# Altium project МЦТР.00010528.00.001.PrjPcb
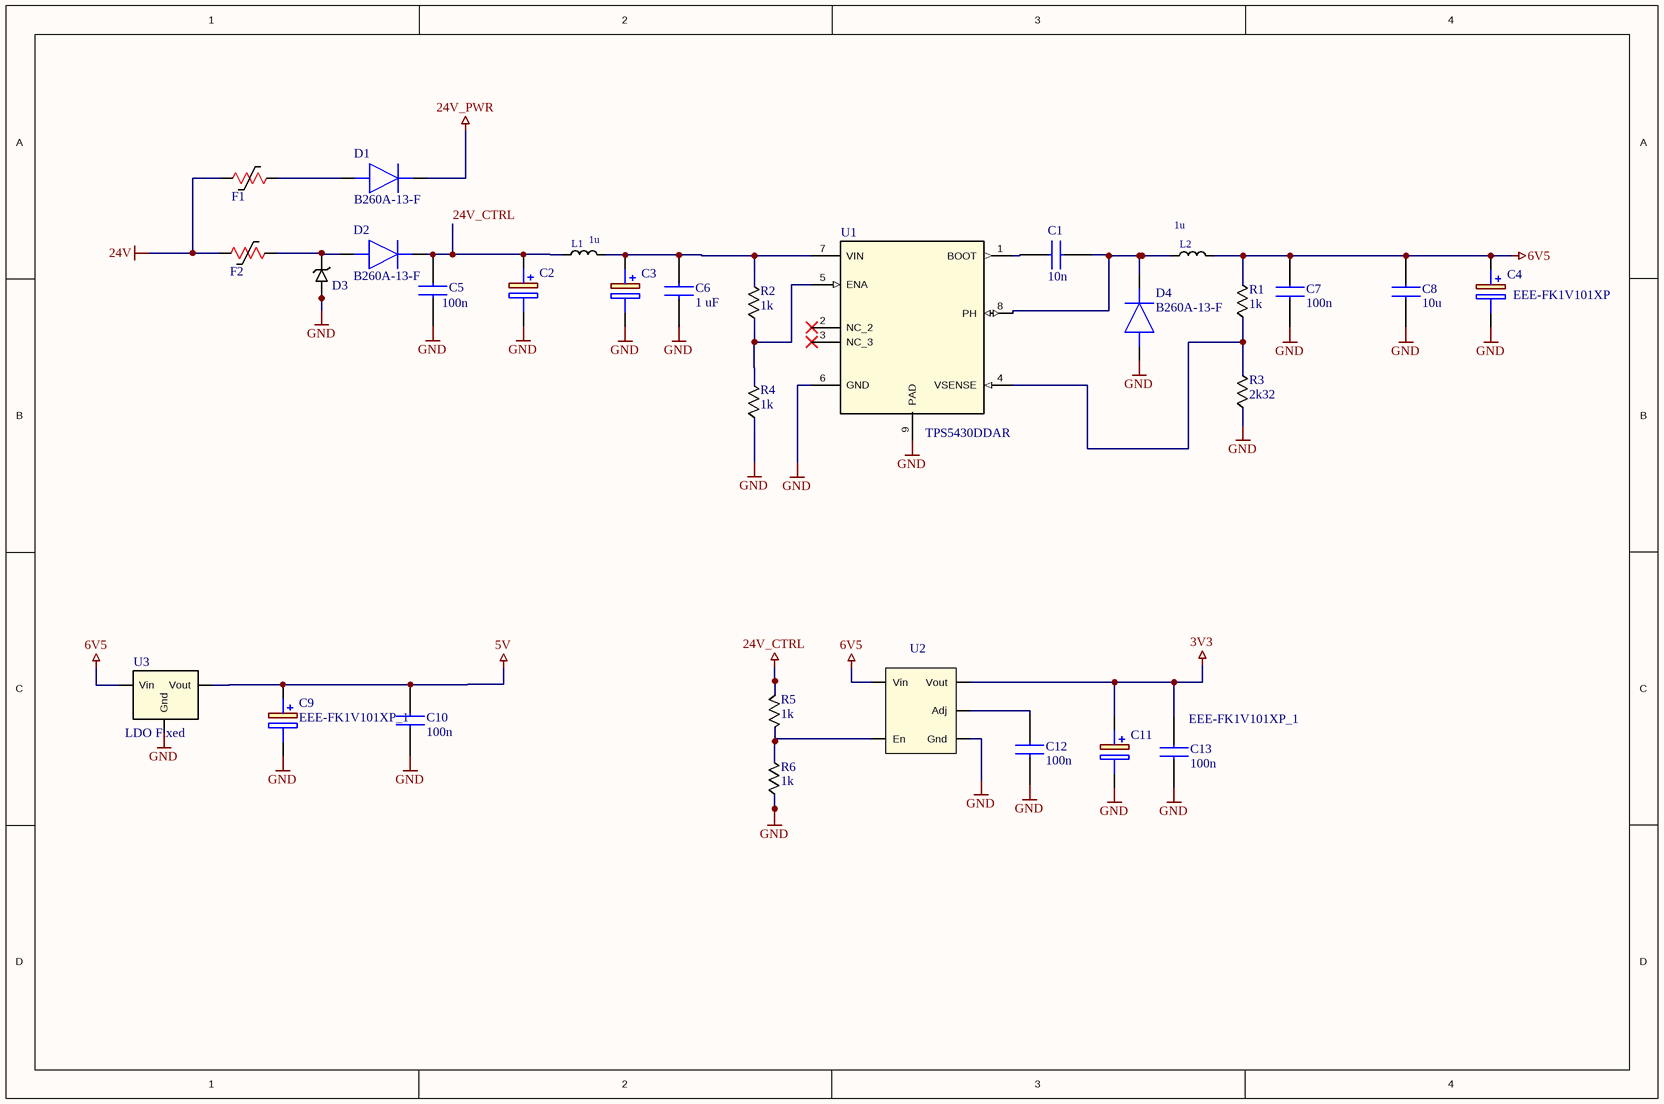
[diagram p0: PSU.SchDoc]
5 sheets, 182 parts. Net scope: global (net labels, ports and power ports of the same name join across sheets).
Board file: PCB1.PcbDoc
Sheets:
  PSU.SchDoc
  MCU.SchDoc
  4-20.SchDoc
  Ethernet.SchDoc
  LEDs.SchDoc

## Sheet PSU.SchDoc
size A4

### Parts
C1  10n  [0603 CAP]
C2  EEE-FK1V101XP  [EEE0JA331XP]  (value not drawn)
C3  EEE-FK1V101XP  [EEE0JA331XP]  (value not drawn)
C4  EEE-FK1V101XP  [EEE0JA331XP]
C5  100n  [0603 CAP]
C6  1 uF  [0603 CAP]
C7  100n  [0603 CAP]
C8  10u  [0603 CAP]
C9  EEE-FK1V101XP_1  [EEE1AA220WR]
C10  100n  [0603 CAP]
C11  EEE-FK1V101XP_1  [EEE1AA220WR]
C12  100n  [0603 CAP]
C13  100n  [0603 CAP]
D1  B260A-13-F  [DO-214AC / SMA - POL]
D2  B260A-13-F  [DO-214AC / SMA - POL]
D3  TVS Diode  [DO-214AC / SMA - POL]  (value not drawn)
D4  B260A-13-F  [DO-214AC / SMA - POL]
F1  MF-USMF005-2  [MF-MSMF030-2]  (value not drawn)
F2  MF-USMF005-2  [MF-MSMF030-2]  (value not drawn)
L1  1u  [CDRH127/LDNP]
L2  1u  [cdRH127/LDNP]
R1  1k  [0603 CAP]
R2  1k  [0603 CAP]
R3  2k32  [0603 CAP]
R4  1k  [0603 CAP]
R5  1k  [0603 CAP]
R6  1k  [0603 CAP]
U1  TPS5430DDAR  [SOIC8 pad]
U2  LDO with Enable Pin  [SOT-23-5]  (value not drawn)
U3  LDO Fixed  [SOT-223]

### Nets
3V3: C11.1(+) C13.2 U2.5(Vout)
5V: C9.1(+) C10.2 U3.2(Vout)
6V5: C4.1(+) C7.2 C8.2 L2.2 R1.2 U2.1(Vin) U3.3(Vin)
24V: F1.2 F2.2
24V_CTRL: C2.1(+) C5.2 D2.2(K) L1.1 R5.1
24V_PWR: D1.2(K)
GND: C2.2(-) C3.2(-) C4.2(-) C5.1 C6.1 C7.1 C8.1 C9.2(-) C10.1 C11.2(-) C12.1 C13.1 D3.1 D4.1(A) R3.1 R4.1 R6.1 U1.6(GND) U1.9(PAD) U2.2(Gnd) U3.1(Gnd)
NetC1_1: C1.1 U1.1(BOOT)
NetC1_2: C1.2 D4.2(K) L2.1 U1.8(PH)
NetC3_1: C3.1(+) C6.2 L1.2 R2.2 U1.7(VIN)
NetC12_2: C12.2 U2.4(Adj)
NetD1_1: D1.1(A) F1.1
NetD2_1: D2.1(A) D3.2 F2.1
NetR1_1: R1.1 R3.2 U1.4(VSENSE)
NetR2_1: R2.1 R4.2 U1.5(ENA)
NetR5_2: R5.2 R6.2 U2.3(En)

Not connected (* = marked no-connect by the designer): U1 2(NC_2)* 3(NC_3)*

### Library data of the parts
C1 = 0603 CAP: GRM188R72A103KA01D; Manufacturer_Name: Murata Electronics; Datasheet Link: https://search.murata.co.jp/Ceramy/image/img/A01X/G101/ENG/GRM188R72A103KA01-01A.pdf; Height: 0.9mm; Manufacturer_Part_Number: GRM188R72A103KA01D; Mouser Part Number: 81-GRM188R72A103KA1D; Mouser Price/Stock: https://www.mouser.co.uk/ProductDetail/Murata-Electronics/GRM188R72A103KA01D?qs=krk%2F6UQjCzAtl9phuocbug%3D%3D; Arrow Part Number: GRM188R72A103KA01D; Arrow Price/Stock: https://www.arrow.com/en/products/grm188r72a103ka01d/murata-manufacturing?region=europe
C2-C4 = EEE-FK1V101XP: Capacitor Polarised; Manufacturer_Name: Panasonic; Datasheet Link: http://industrial.panasonic.com/cdbs/www-data/pdf/RDE0000/ABA0000C1181.pdf; Height: 7.8mm; Manufacturer_Part_Number: EEE-FK1V101XP; Mouser Part Number: 667-EEE-FK1V101XP; Mouser Price/Stock: https://www.mouser.co.uk/ProductDetail/Panasonic/EEE-FK1V101XP?qs=qE6bgDGEOCu46KIpIgG5Yw%3D%3D; Arrow Part Number: EEE-FK1V101XP; Arrow Price/Stock: https://www.arrow.com/en/products/eee-fk1v101xp/panasonic?utm_currency=USD&region=europe
C5 C7 C10 C12 C13 = 0603 CAP: CC0603KRX7R9BB104; Manufacturer_Name: Murata Electronics; Manufacturer_Part_Number: GRM188R72A103KA01D; Datasheet Link: https://search.murata.co.jp/Ceramy/image/img/A01X/G101/ENG/GRM188R72A103KA01-01A.pdf; Height: 0.9mm; Mouser Part Number: 81-GRM188R72A103KA1D; Mouser Price/Stock: https://www.mouser.co.uk/ProductDetail/Murata-Electronics/GRM188R72A103KA01D?qs=krk%2F6UQjCzAtl9phuocbug%3D%3D; Arrow Part Number: GRM188R72A103KA01D; Arrow Price/Stock: https://www.arrow.com/en/products/grm188r72a103ka01d/murata-manufacturing?region=europe
C6 = 0603 CAP: CC0603KRX7R9BB105; Manufacturer_Name: Murata Electronics; Manufacturer_Part_Number: GRM188R72A103KA01D; Datasheet Link: https://search.murata.co.jp/Ceramy/image/img/A01X/G101/ENG/GRM188R72A103KA01-01A.pdf; Height: 0.9mm; Mouser Part Number: 81-GRM188R72A103KA1D; Mouser Price/Stock: https://www.mouser.co.uk/ProductDetail/Murata-Electronics/GRM188R72A103KA01D?qs=krk%2F6UQjCzAtl9phuocbug%3D%3D; Arrow Part Number: GRM188R72A103KA01D; Arrow Price/Stock: https://www.arrow.com/en/products/grm188r72a103ka01d/murata-manufacturing?region=europe
C8 = 0603 CAP: GRM188R61E105KA12D; Manufacturer_Name: Murata Electronics; Manufacturer_Part_Number: GRM188R72A103KA01D; Datasheet Link: https://search.murata.co.jp/Ceramy/image/img/A01X/G101/ENG/GRM188R72A103KA01-01A.pdf; Height: 0.9mm; Mouser Part Number: 81-GRM188R72A103KA1D; Mouser Price/Stock: https://www.mouser.co.uk/ProductDetail/Murata-Electronics/GRM188R72A103KA01D?qs=krk%2F6UQjCzAtl9phuocbug%3D%3D; Arrow Part Number: GRM188R72A103KA01D; Arrow Price/Stock: https://www.arrow.com/en/products/grm188r72a103ka01d/murata-manufacturing?region=europe
C9 C11 = EEE-FK1V101XP_1: EEEFK1C100R; Manufacturer_Name: Panasonic; Datasheet Link: http://industrial.panasonic.com/cdbs/www-data/pdf/RDE0000/ABA0000C1181.pdf; Height: 7.8mm; Manufacturer_Part_Number: EEE-FK1V101XP; Mouser Part Number: 667-EEE-FK1V101XP; Mouser Price/Stock: https://www.mouser.co.uk/ProductDetail/Panasonic/EEE-FK1V101XP?qs=qE6bgDGEOCu46KIpIgG5Yw%3D%3D; Arrow Part Number: EEE-FK1V101XP; Arrow Price/Stock: https://www.arrow.com/en/products/eee-fk1v101xp/panasonic?utm_currency=USD&region=europe
D1 D2 D4 = B260A-13-F: Diode; Manufacturer_Name: Diodes Incorporated; Datasheet Link: https://componentsearchengine.com/Datasheets/2/B260A-13-F.pdf; Height: 2.3mm; Manufacturer_Part_Number: B260A-13-F; Mouser Part Number: 621-B260A-F; Mouser Price/Stock: https://www.mouser.co.uk/ProductDetail/Diodes-Incorporated/B260A-13-F?qs=9XwZYT68TnR%252B3fnyovGFLA%3D%3D; Arrow Part Number: B260A-13-F; Arrow Price/Stock: https://www.arrow.com/en/products/b260a-13-f/diodes-incorporated?region=nac
D3 = TVS_1_Uni: TVS Protective Diode Uni
F1 F2 = Fuse Resettable: Resettable Fuse Polyswitch
L1 L2 = Inductor CDRH127: SMD 0805; Value: 1u
R1 R2 R4-R6 = 0603 RES
R3 = RES 0603: RC0603FR-072K32L
U2 = LM8805
U3 = LDO Fixed S

## Sheet MCU.SchDoc
size A3
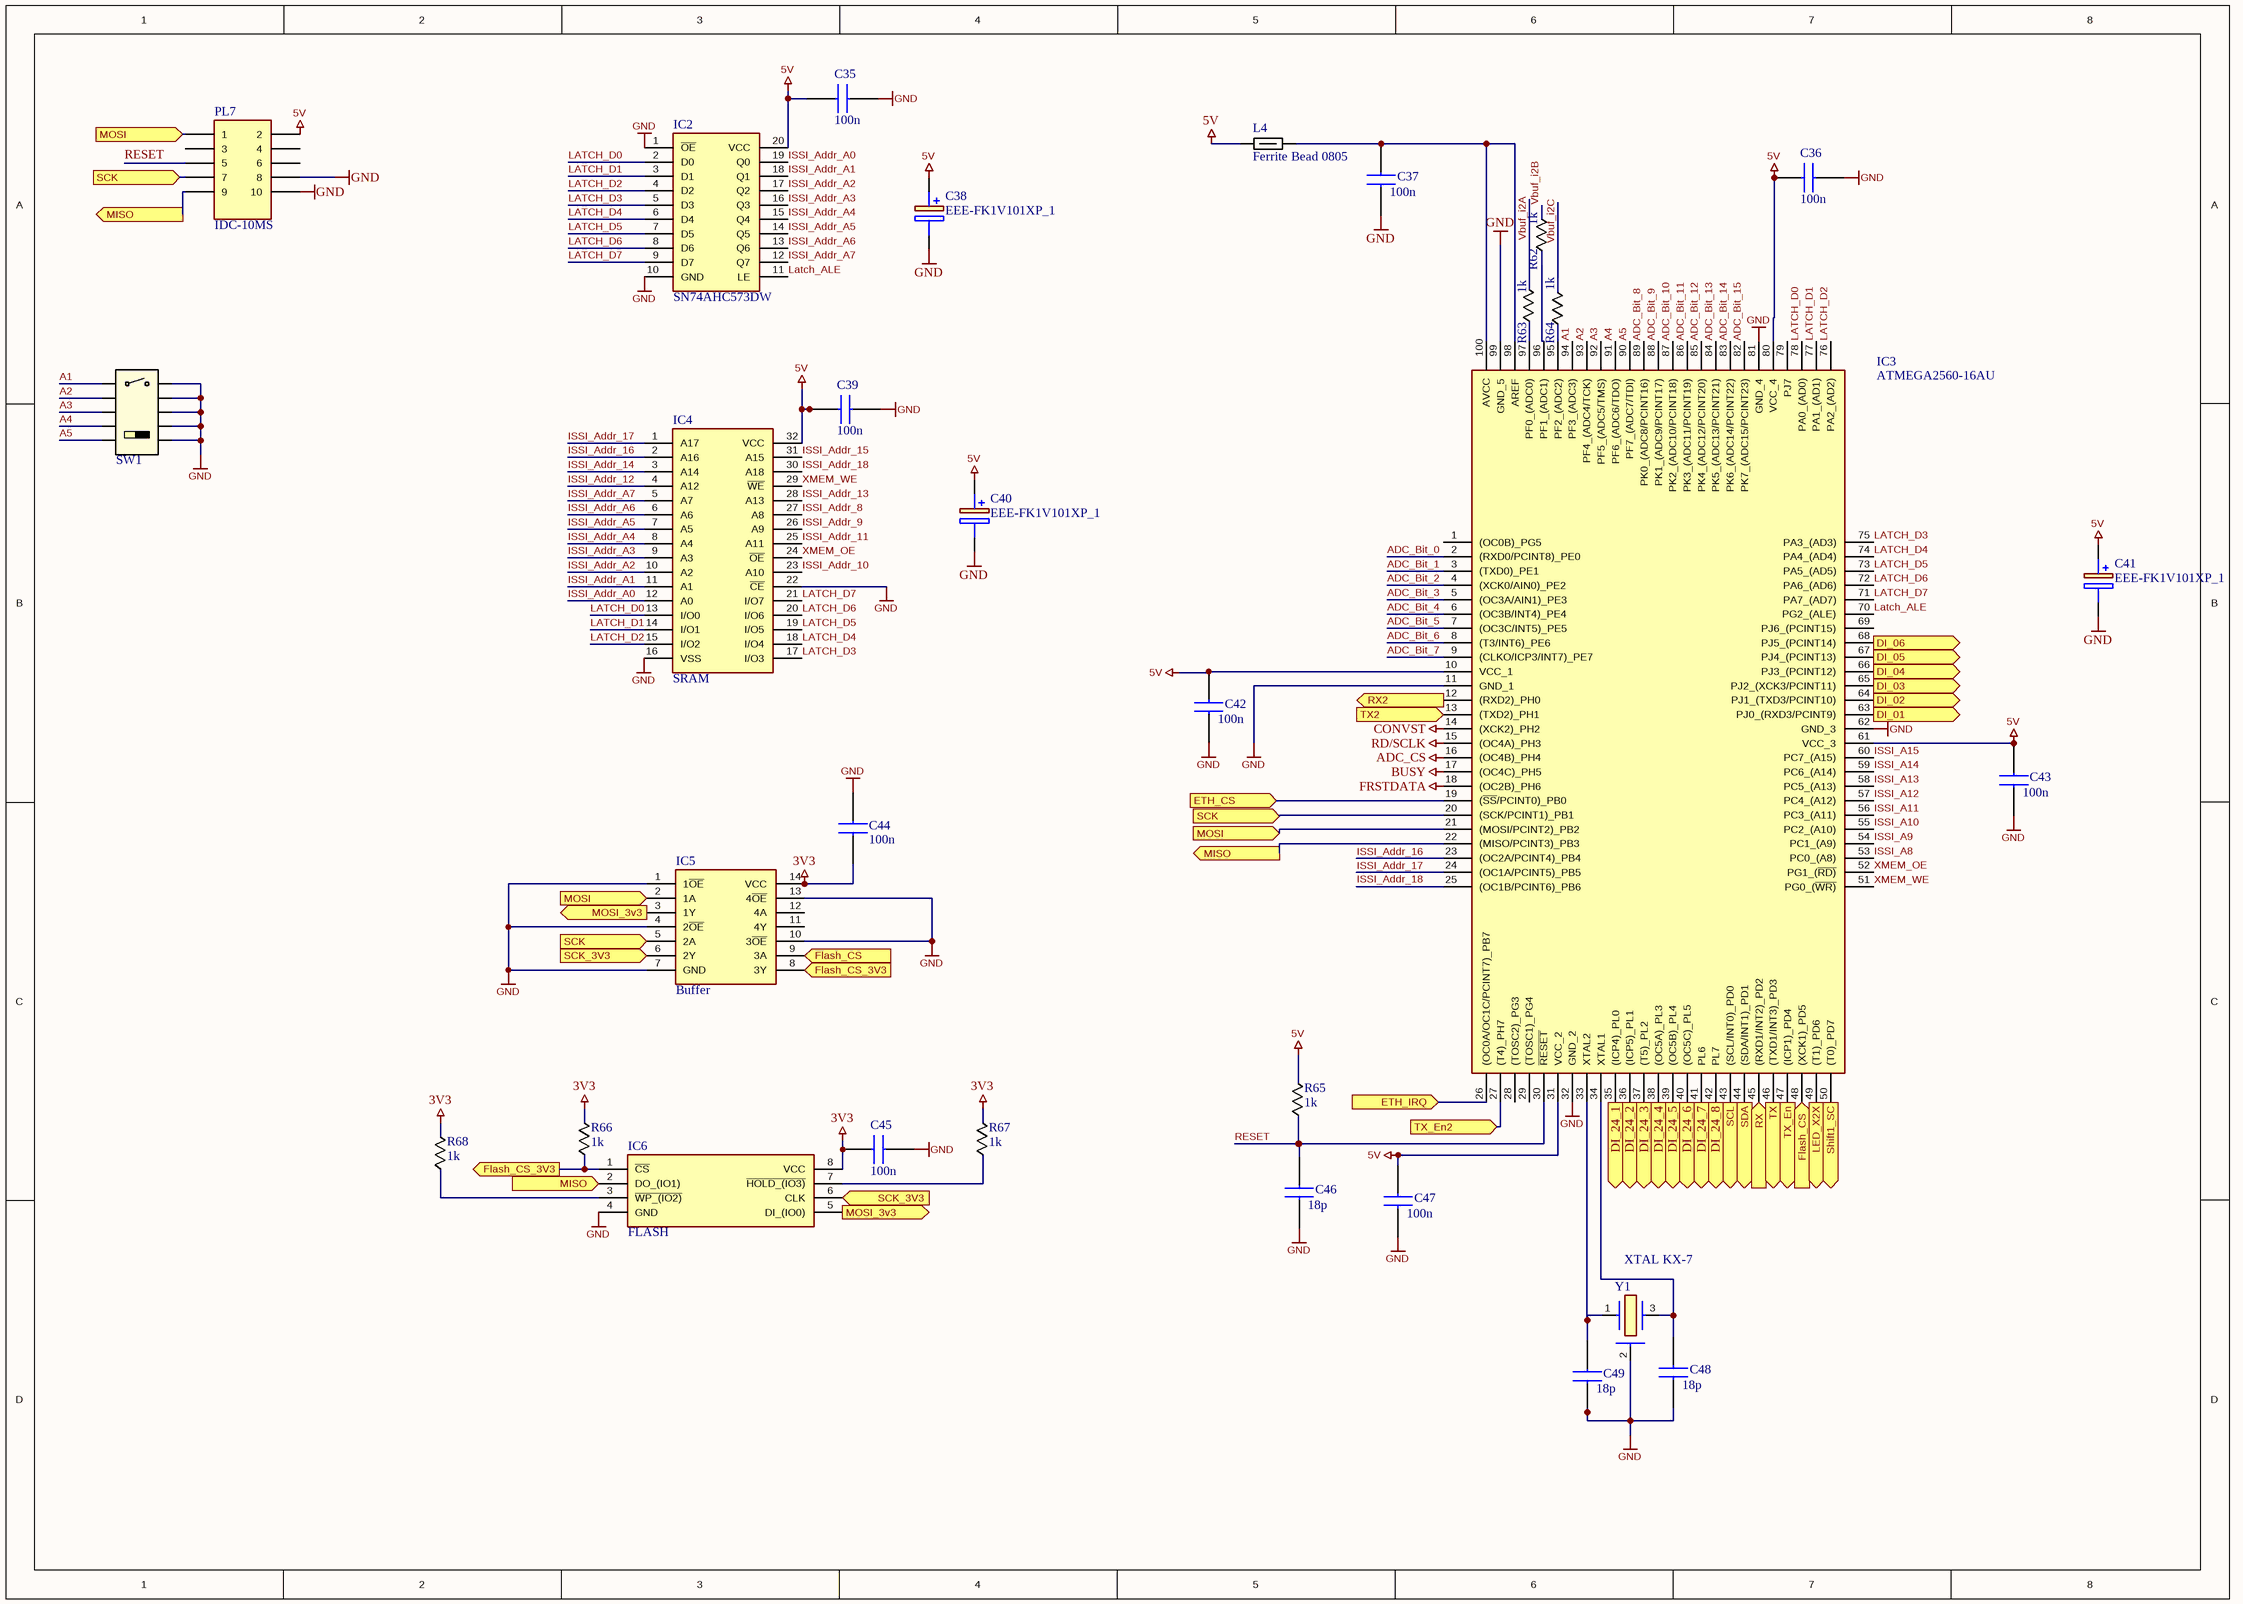
[diagram p1: MCU.SchDoc]

### Parts
C35  100n  [0603 CAP]
C36  100n  [0603 CAP]
C37  100n  [0603 CAP]
C38  EEE-FK1V101XP_1  [EEE1AA220WR]
C39  100n  [0603 CAP]
C40  EEE-FK1V101XP_1  [EEE1AA220WR]
C41  EEE-FK1V101XP_1  [EEE1AA220WR]
C42  100n  [0603 CAP]
C43  100n  [0603 CAP]
C44  100n  [0603 CAP]
C45  100n  [0603 CAP]
C46  18p  [0603 CAP]
C47  100n  [0603 CAP]
C48  18p  [0603 CAP]
C49  18p  [0603 CAP]
IC2  SN74AHC573DW  [SOIC-20N]
IC3  ATMEGA2560-16AU  [QFP-100N]
IC4  SRAM  [SOIC32]
IC5  Buffer  [SOP-14N]
IC6  FLASH  [SOIC-8]
L4  Ferrite Bead 0805  [BLM21AG102BH1J]
PL7  IDC-10MS  [DS101310SSIB1B0]
R62  1k  [0603 CAP]
R63  1k  [0603 CAP]
R64  1k  [0603 CAP]
R65  1k  [0603 CAP]
R66  1k  [0603 CAP]
R67  1k  [0603 CAP]
R68  1k  [0603 CAP]
SW1  DIP-Switch 5 Pins  [Switch DIP-5]  (value not drawn)
Y1  XTAL KX-7  [XTAL KX-7]

### Ports
DI_01, DI_02, DI_03, DI_04, DI_05, DI_06, DI_24_1, DI_24_2, DI_24_3, DI_24_4, DI_24_5, DI_24_6, DI_24_7, DI_24_8, ETH_CS, ETH_IRQ, Flash_CS, Flash_CS_3V3, LED_X2X, MISO, MOSI, MOSI_3v3, RX, RX2, SCK, SCK_3V3, SCL, SDA, Shift1_SC, TX, TX2, TX_En, TX_En2

### Nets
3V3: C44.1 C45.1 IC5.14(VCC) IC6.8(VCC) R66.2 R67.2 R68.2
5V: C35.2 C36.2 C38.1(+) C39.2 C40.1(+) C41.1(+) C42.2 C43.2 C47.2 IC2.20(VCC) IC3.10(VCC_1) IC3.31(VCC_2) IC3.61(VCC_3) IC3.80(VCC_4) IC4.32(VCC) L4.1 PL7.2 R65.2
ADC_CS: IC3.16((OC4B)_PH4)
BUSY: IC3.17((OC4C)_PH5)
CONVST: IC3.14((XCK2)_PH2)
FRSTDATA: IC3.18((OC2B)_PH6)
GND: C35.1 C36.1 C37.1 C38.2(-) C39.1 C40.2(-) C41.2(-) C42.1 C43.1 C44.2 C45.2 C46.1 C47.1 C48.1 C49.1 IC2.1(~{OE}) IC2.10(GND) IC3.11(GND_1) IC3.32(GND_2) IC3.62(GND_3) IC3.81(GND_4) IC3.99(GND_5) IC4.16(VSS) IC4.22(~{CE}) IC5.1(1~{OE}) IC5.4(2~{OE}) IC5.7(GND) IC5.10(3~{OE}) IC5.13(4~{OE}) IC6.4(GND) PL7.8 PL7.10 SW1.2 SW1.4 SW1.6 SW1.8 SW1.10 Y1.2
RD/SCLK: IC3.15((OC4A)_PH3)
A1: IC3.94(PF3_(ADC3)) SW1.1
A2: IC3.93(PF4_(ADC4/TCK)) SW1.3
A3: IC3.92(PF5_(ADC5/TMS)) SW1.5
A4: IC3.91(PF6_(ADC6/TDO)) SW1.7
A5: IC3.90(PF7_(ADC7/TDI)) SW1.9
ADC_Bit_0: IC3.2((RXD0/PCINT8)_PE0)
ADC_Bit_1: IC3.3((TXD0)_PE1)
ADC_Bit_2: IC3.4((XCK0/AIN0)_PE2)
ADC_Bit_3: IC3.5((OC3A/AIN1)_PE3)
ADC_Bit_4: IC3.6((OC3B/INT4)_PE4)
ADC_Bit_5: IC3.7((OC3C/INT5)_PE5)
ADC_Bit_6: IC3.8((T3/INT6)_PE6)
ADC_Bit_7: IC3.9((CLKO/ICP3/INT7)_PE7)
ADC_Bit_8: IC3.89(PK0_(ADC8/PCINT16))
ADC_Bit_9: IC3.88(PK1_(ADC9/PCINT17))
ADC_Bit_10: IC3.87(PK2_(ADC10/PCINT18))
ADC_Bit_11: IC3.86(PK3_(ADC11/PCINT19))
ADC_Bit_12: IC3.85(PK4_(ADC12/PCINT20))
ADC_Bit_13: IC3.84(PK5_(ADC13/PCINT21))
ADC_Bit_14: IC3.83(PK6_(ADC14/PCINT22))
ADC_Bit_15: IC3.82(PK7_(ADC15/PCINT23))
DI_01: IC3.63(PJ0_(RXD3/PCINT9)) ; port DI_01
DI_02: IC3.64(PJ1_(TXD3/PCINT10)) ; port DI_02
DI_03: IC3.65(PJ2_(XCK3/PCINT11)) ; port DI_03
DI_04: IC3.66(PJ3_(PCINT12)) ; port DI_04
DI_05: IC3.67(PJ4_(PCINT13)) ; port DI_05
DI_06: IC3.68(PJ5_(PCINT14)) ; port DI_06
DI_24_1: IC3.35((ICP4)_PL0) ; port DI_24_1
DI_24_2: IC3.36((ICP5)_PL1) ; port DI_24_2
DI_24_3: IC3.37((T5)_PL2) ; port DI_24_3
DI_24_4: IC3.38((OC5A)_PL3) ; port DI_24_4
DI_24_5: IC3.39((OC5B)_PL4) ; port DI_24_5
DI_24_6: IC3.40((OC5C)_PL5) ; port DI_24_6
DI_24_7: IC3.41(PL6) ; port DI_24_7
DI_24_8: IC3.42(PL7) ; port DI_24_8
ETH_CS: IC3.19((~{SS}/PCINT0)_PB0) ; port ETH_CS
ETH_IRQ: IC3.26((OC0A/OC1C/PCINT7)_PB7) ; port ETH_IRQ
Flash_CS: IC3.48((XCK1)_PD5) IC5.9(3A) ; port Flash_CS
Flash_CS_3V3: IC5.8(3Y) IC6.1(~{CS}) R66.1 ; port Flash_CS_3V3
ISSI_A8: IC3.53(PC0_(A8))
ISSI_A9: IC3.54(PC1_(A9))
ISSI_A10: IC3.55(PC2_(A10))
ISSI_A11: IC3.56(PC3_(A11))
ISSI_A12: IC3.57(PC4_(A12))
ISSI_A13: IC3.58(PC5_(A13))
ISSI_A14: IC3.59(PC6_(A14))
ISSI_A15: IC3.60(PC7_(A15))
ISSI_Addr_8: IC4.27(A8)
ISSI_Addr_9: IC4.26(A9)
ISSI_Addr_10: IC4.23(A10)
ISSI_Addr_11: IC4.25(A11)
ISSI_Addr_12: IC4.4(A12)
ISSI_Addr_13: IC4.28(A13)
ISSI_Addr_14: IC4.3(A14)
ISSI_Addr_15: IC4.31(A15)
ISSI_Addr_16: IC3.23((OC2A/PCINT4)_PB4) IC4.2(A16)
ISSI_Addr_17: IC3.24((OC1A/PCINT5)_PB5) IC4.1(A17)
ISSI_Addr_18: IC3.25((OC1B/PCINT6)_PB6) IC4.30(A18)
ISSI_Addr_A0: IC2.19(Q0) IC4.12(A0)
ISSI_Addr_A1: IC2.18(Q1) IC4.11(A1)
ISSI_Addr_A2: IC2.17(Q2) IC4.10(A2)
ISSI_Addr_A3: IC2.16(Q3) IC4.9(A3)
ISSI_Addr_A4: IC2.15(Q4) IC4.8(A4)
ISSI_Addr_A5: IC2.14(Q5) IC4.7(A5)
ISSI_Addr_A6: IC2.13(Q6) IC4.6(A6)
ISSI_Addr_A7: IC2.12(Q7) IC4.5(A7)
Latch_ALE: IC2.11(LE) IC3.70(PG2_(ALE))
LATCH_D0: IC2.2(D0) IC3.78(PA0_(AD0)) IC4.13(I/O0)
LATCH_D1: IC2.3(D1) IC3.77(PA1_(AD1)) IC4.14(I/O1)
LATCH_D2: IC2.4(D2) IC3.76(PA2_(AD2)) IC4.15(I/O2)
LATCH_D3: IC2.5(D3) IC3.75(PA3_(AD3)) IC4.17(I/O3)
LATCH_D4: IC2.6(D4) IC3.74(PA4_(AD4)) IC4.18(I/O4)
LATCH_D5: IC2.7(D5) IC3.73(PA5_(AD5)) IC4.19(I/O5)
LATCH_D6: IC2.8(D6) IC3.72(PA6_(AD6)) IC4.20(I/O6)
LATCH_D7: IC2.9(D7) IC3.71(PA7_(AD7)) IC4.21(I/O7)
LED_X2X: IC3.49((T1)_PD6) ; port LED_X2X
MISO: IC3.22((MISO/PCINT3)_PB3) IC6.2(DO_(IO1)) PL7.9 ; port MISO
MOSI: IC3.21((MOSI/PCINT2)_PB2) IC5.2(1A) PL7.1 ; port MOSI
MOSI_3v3: IC5.3(1Y) IC6.5(DI_(IO0)) ; port MOSI_3v3
RESET: C46.2 IC3.30(~{RESET}) PL7.5 R65.1
RX: IC3.45((RXD1/INT2)_PD2) ; port RX
RX2: IC3.12((RXD2)_PH0) ; port RX2
SCK: IC3.20((SCK/PCINT1)_PB1) IC5.5(2A) PL7.7 ; port SCK
SCK_3V3: IC5.6(2Y) IC6.6(CLK) ; port SCK_3V3
SCL: IC3.43((SCL/INT0)_PD0) ; port SCL
SDA: IC3.44((SDA/INT1)_PD1) ; port SDA
Shift1_SC: IC3.50((T0)_PD7) ; port Shift1_SC
TX: IC3.46((TXD1/INT3)_PD3) ; port TX
TX2: IC3.13((TXD2)_PH1) ; port TX2
TX_En: IC3.47((ICP1)_PD4) ; port TX_En
TX_En2: IC3.27((T4)_PH7) ; port TX_En2
Vbuf_i2A: R63.2
Vbuf_i2B: R62.2
Vbuf_i2C: R64.2
XMEM_OE: IC3.52(PG1_(~{RD)}) IC4.24(~{OE})
XMEM_WE: IC3.51(PG0_(~{WR)}) IC4.29(~{WE})
NetC37_2: C37.2 IC3.98(AREF) IC3.100(AVCC) L4.2
NetC48_2: C48.2 IC3.34(XTAL1) Y1.3
NetC49_2: C49.2 IC3.33(XTAL2) Y1.1
NetIC3_95: IC3.95(PF2_(ADC2)) R64.1
NetIC3_96: IC3.96(PF1_(ADC1)) R62.1
NetIC3_97: IC3.97(PF0_(ADC0)) R63.1
NetIC6_3: IC6.3(~{WP_(IO2)}) R68.1
NetIC6_7: IC6.7(~{HOLD_(IO3)}) R67.1

Not connected (* = marked no-connect by the designer): IC3 1((OC0B)_PG5) 28((TOSC2)_PG3) 29((TOSC1)_PG4) 69(PJ6_(PCINT15)) 79(PJ7); IC5 11(4Y) 12(4A); PL7 3 4 6

### Library data of the parts
C35-C37 C39 C42-C45 C47 = 0603 CAP: as C5 on sheet PSU; Datasheet Link: https://search.murata.co.jp/Ceramy/image/img/A01X/G101/ENG/GRM188R72A103KA01-01A.pdf; Height: 0.9mm; Mouser Part Number: 81-GRM188R72A103KA1D; Mouser Price/Stock: https://www.mouser.co.uk/ProductDetail/Murata-Electronics/GRM188R72A103KA01D?qs=krk%2F6UQjCzAtl9phuocbug%3D%3D; Arrow Part Number: GRM188R72A103KA01D; Arrow Price/Stock: https://www.arrow.com/en/products/grm188r72a103ka01d/murata-manufacturing?region=europe
C38 C40 C41 = EEE-FK1V101XP_1: as C9 on sheet PSU; Datasheet Link: http://industrial.panasonic.com/cdbs/www-data/pdf/RDE0000/ABA0000C1181.pdf; Height: 7.8mm; Manufacturer_Part_Number: EEE-FK1V101XP; Mouser Part Number: 667-EEE-FK1V101XP; Mouser Price/Stock: https://www.mouser.co.uk/ProductDetail/Panasonic/EEE-FK1V101XP?qs=qE6bgDGEOCu46KIpIgG5Yw%3D%3D; Arrow Part Number: EEE-FK1V101XP; Arrow Price/Stock: https://www.arrow.com/en/products/eee-fk1v101xp/panasonic?utm_currency=USD&region=europe
C46 C48 C49 = 0603 CAP: CC0603JRNPO9BN180; Manufacturer_Name: Murata Electronics; Manufacturer_Part_Number: GRM188R72A103KA01D; Datasheet Link: https://search.murata.co.jp/Ceramy/image/img/A01X/G101/ENG/GRM188R72A103KA01-01A.pdf; Height: 0.9mm; Mouser Part Number: 81-GRM188R72A103KA1D; Mouser Price/Stock: https://www.mouser.co.uk/ProductDetail/Murata-Electronics/GRM188R72A103KA01D?qs=krk%2F6UQjCzAtl9phuocbug%3D%3D; Arrow Part Number: GRM188R72A103KA01D; Arrow Price/Stock: https://www.arrow.com/en/products/grm188r72a103ka01d/murata-manufacturing?region=europe
IC2 = 74HC573D,653: Integrated Circuit; Manufacturer_Name: Nexperia; Datasheet Link: https://assets.nexperia.com/documents/data-sheet/74HC_HCT573.pdf; Height: 2.65mm; Manufacturer_Part_Number: 74HC573D,653; Mouser Part Number: 771-74HC573D-T; Mouser Price/Stock: https://www.mouser.co.uk/ProductDetail/Nexperia/74HC573D653?qs=P62ublwmbi8WfKX2wZR8SA%3D%3D; Arrow Part Number: 74HC573D,653; Arrow Price/Stock: https://www.arrow.com/en/products/74hc573d653/nexperia?utm_currency=USD&region=europe
IC3 = ATMEGA2560-16AU: Integrated Circuit; Manufacturer_Name: Microchip; Datasheet Link: https://datasheet.datasheetarchive.com/originals/distributors/Datasheets_SAMA/4a5a397fa76c39b5297f4121ace1d84e.pdf; Height: 1.2mm; Manufacturer_Part_Number: ATMEGA2560-16AU; Mouser Part Number: 556-ATMEGA2560-16AU; Mouser Price/Stock: https://www.mouser.co.uk/ProductDetail/Microchip-Technology/ATMEGA2560-16AU?qs=aqrrBurbvGciYmlAokFS0w%3D%3D; Arrow Part Number: ATMEGA2560-16AU; Arrow Price/Stock: null?region=nac
IC4 = CY62148ELL-55SXI: Manufacturer_Name: Infineon; Datasheet Link: https://componentsearchengine.com/Datasheets/2/CY62148ELL-55SXI.pdf; Height: 2.997mm; Manufacturer_Part_Number: CY62148ELL-55SXI; Mouser Part Number: 727-CY62148ELL-55SXI; Mouser Price/Stock: https://www.mouser.co.uk/ProductDetail/Cypress-Semiconductor/CY62148ELL-55SXI?qs=k2piNBSag3%252BZl%2FeQyEY%2FXw%3D%3D; Arrow Part Number: CY62148ELL-55SXI; Arrow Price/Stock: https://www.arrow.com/en/products/cy62148ell-55sxi/cypress-semiconductor
IC5 = 74LVC125APW,118: Manufacturer_Name: Nexperia; Datasheet Link: https://assets.nexperia.com/documents/data-sheet/74LVC125A.pdf; Height: 1.1mm; Manufacturer_Part_Number: 74LVC125APW,118; Mouser Part Number: 771-74LVC125APW-T; Mouser Price/Stock: https://www.mouser.co.uk/ProductDetail/Nexperia/74LVC125APW118?qs=me8TqzrmIYV8VAZOS5KVLw%3D%3D; Arrow Part Number: 74LVC125APW,118; Arrow Price/Stock: https://www.arrow.com/en/products/74lvc125apw118/nexperia?utm_currency=USD&region=nac
IC6 = W25Q64FVSSIG: Manufacturer_Name: Winbond; Datasheet Link: https://www.winbond.com/resource-files/w25q64fv revq 06142016.pdf; Height: 2.16mm; Manufacturer_Part_Number: W25Q64FVSSIG; Mouser Part Number: N/A; Mouser Price/Stock: https://www.mouser.co.uk/ProductDetail/Winbond/W25Q64FVSSIG?qs=rkhjVJ6%2F3EIyeN0wt4XchA%3D%3D; Arrow Part Number: W25Q64FVSSIG; Arrow Price/Stock: https://www.arrow.com/en/products/w25q64fvssig/winbond-electronics
L4 = Ferrite Bead
PL7 = IDC-10MS: DS1013-10SSiB1-B-0
R62-R68 = 0603 RES
SW1 = Switch DIP-5: DIP-Switch NDP-05
Y1 = XTAL KX-7: Crystal or Oscillator; Manufacturer_Name: NDK; Manufacturer_Part_Number: NX3215SA-32.768K-STD-MUA-14; Datasheet Link: https://www.mouser.com/datasheet/2/905/c_NX3215SA-STD-MUA-14_e-1317539.pdf; Height: 0.9mm; Mouser Part Number: 344-NX3215SA32768K14; Mouser Price/Stock: https://www.mouser.co.uk/ProductDetail/NDK/NX3215SA-32.768K-STD-MUA-14?qs=55YtniHzbhCTyKGENMTVrQ%3D%3D

## Sheet 4-20.SchDoc
size A3
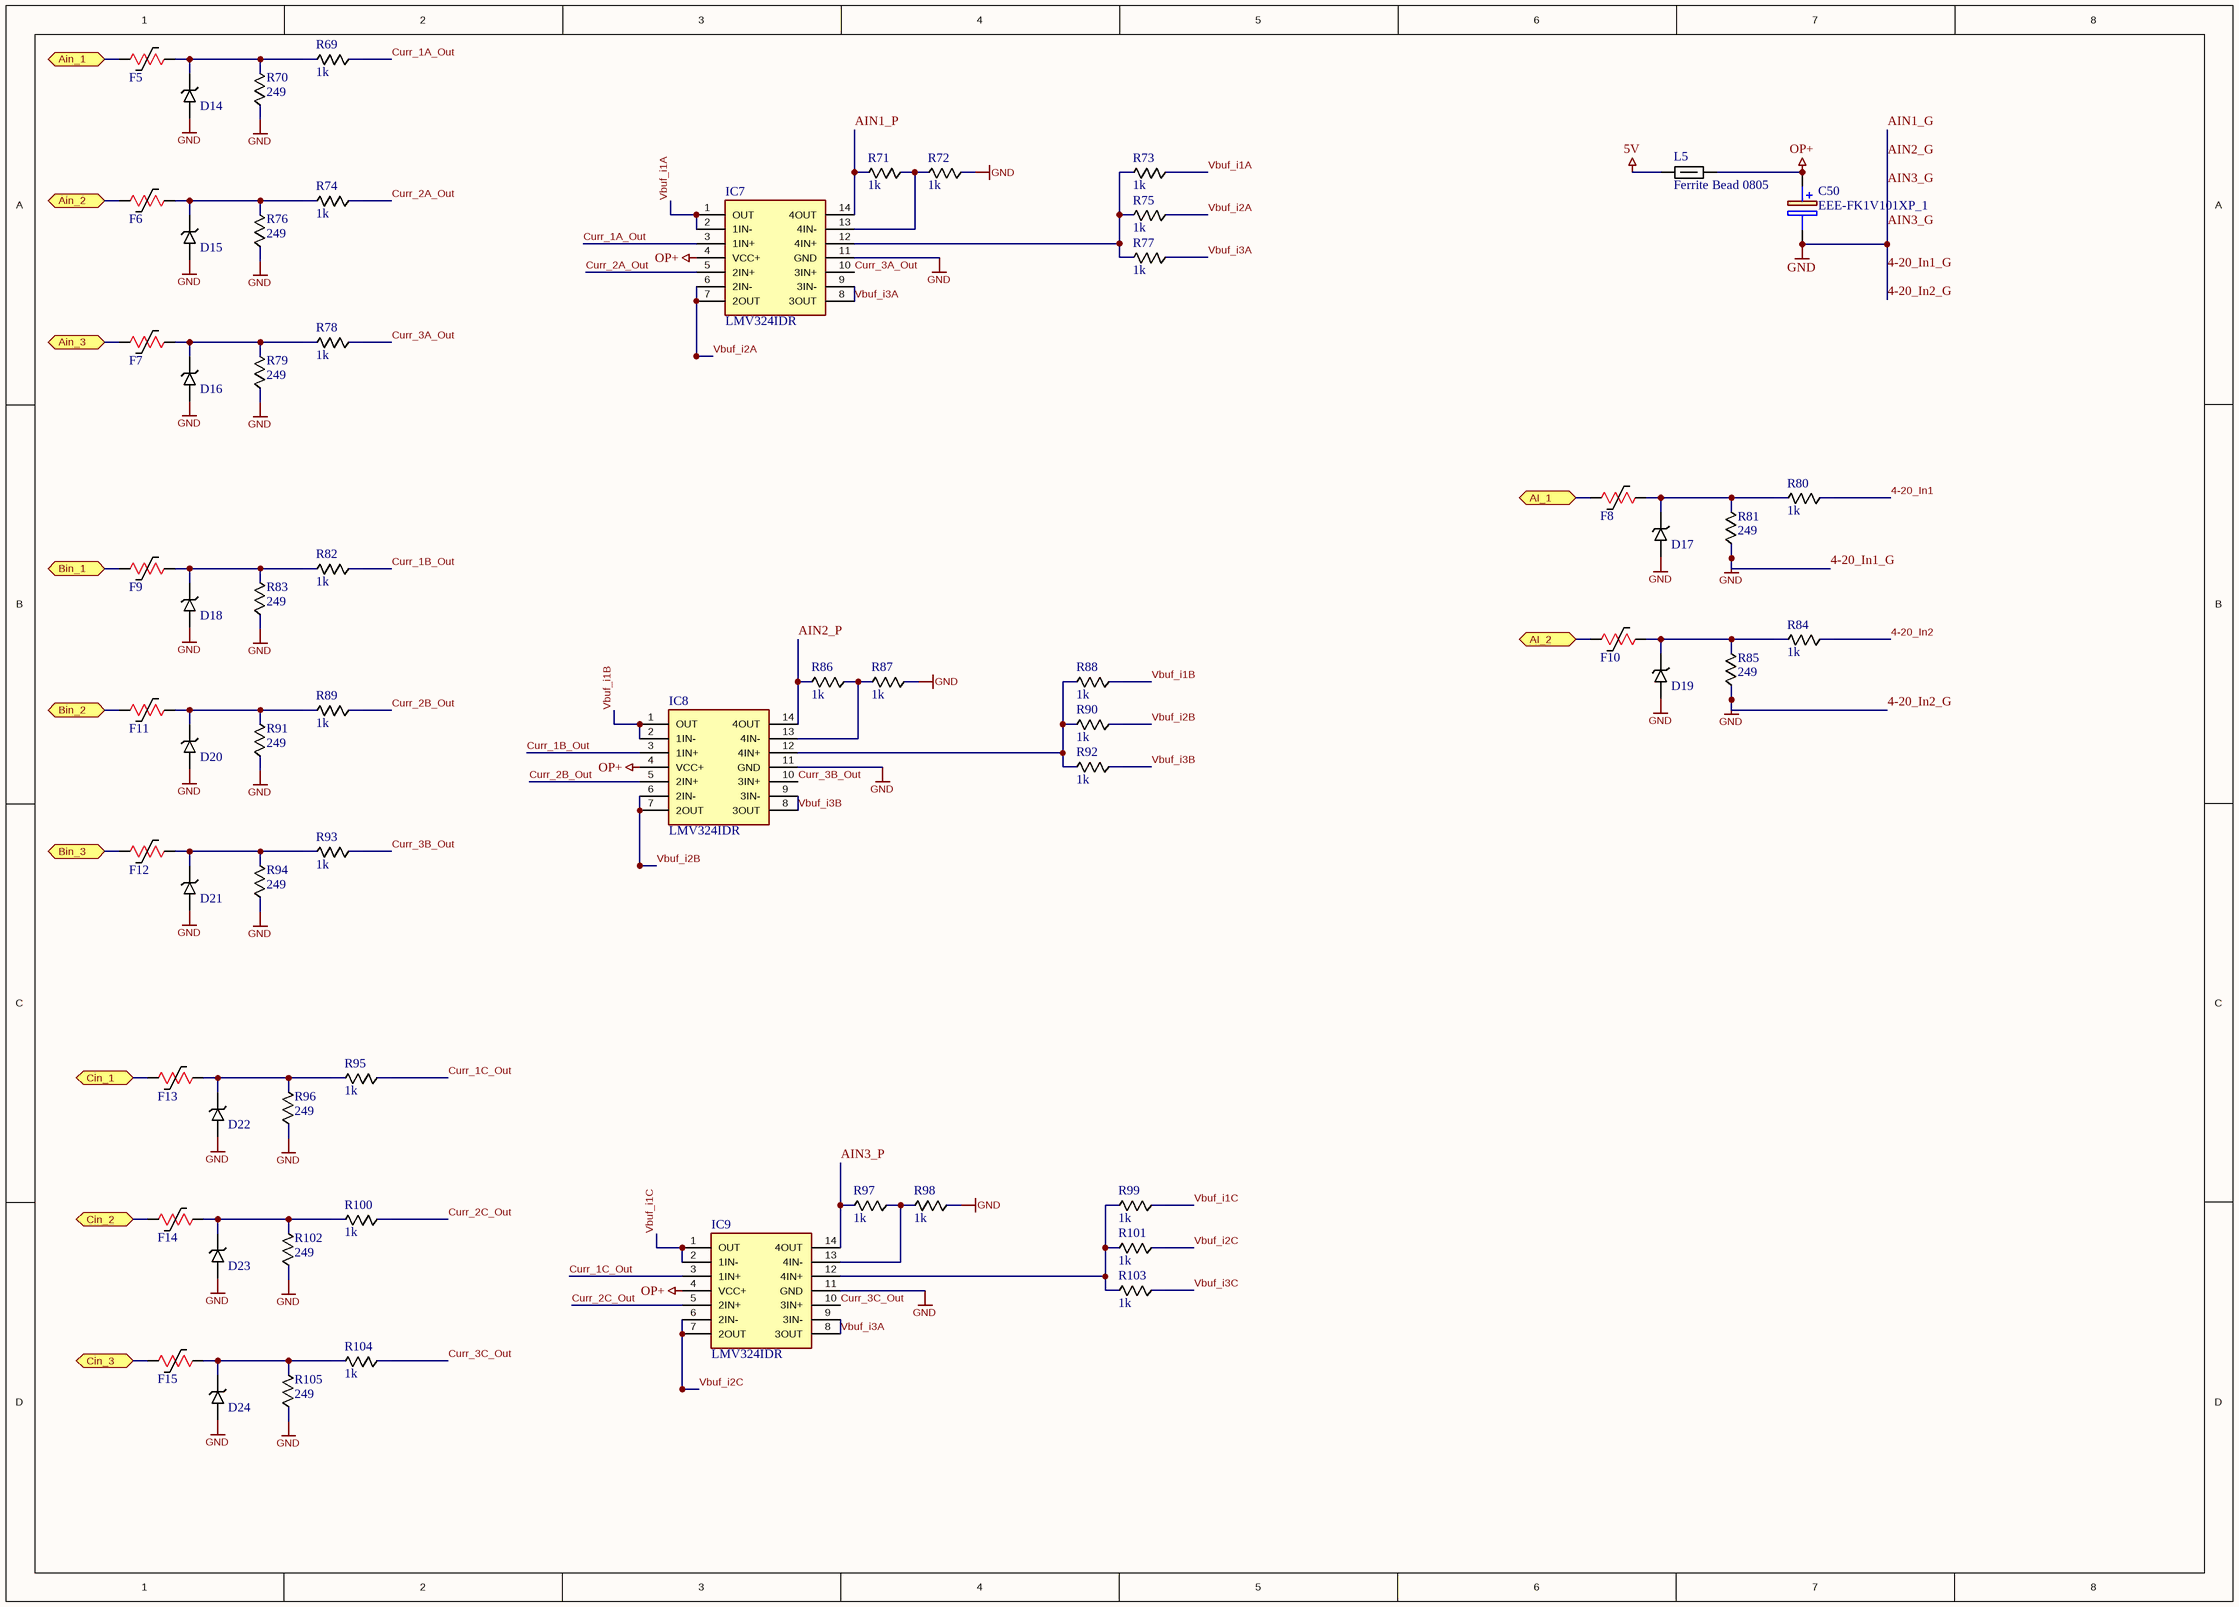
[diagram p2: 4-20.SchDoc]

### Parts
C50  EEE-FK1V101XP_1  [EEE1AA220WR]
D14  TVS Diode  [DO-214AC / SMA - POL]  (value not drawn)
D15  TVS Diode  [DO-214AC / SMA - POL]  (value not drawn)
D16  TVS Diode  [DO-214AC / SMA - POL]  (value not drawn)
D17  TVS Diode  [DO-214AC / SMA - POL]  (value not drawn)
D18  TVS Diode  [DO-214AC / SMA - POL]  (value not drawn)
D19  TVS Diode  [DO-214AC / SMA - POL]  (value not drawn)
D20  TVS Diode  [DO-214AC / SMA - POL]  (value not drawn)
D21  TVS Diode  [DO-214AC / SMA - POL]  (value not drawn)
D22  TVS Diode  [DO-214AC / SMA - POL]  (value not drawn)
D23  TVS Diode  [DO-214AC / SMA - POL]  (value not drawn)
D24  TVS Diode  [DO-214AC / SMA - POL]  (value not drawn)
F5  MF-USMF005-2  [MF-MSMF030-2]  (value not drawn)
F6  MF-USMF005-2  [MF-MSMF030-2]  (value not drawn)
F7  MF-USMF005-2  [MF-MSMF030-2]  (value not drawn)
F8  MF-USMF005-2  [MF-MSMF030-2]  (value not drawn)
F9  MF-USMF005-2  [MF-MSMF030-2]  (value not drawn)
F10  MF-USMF005-2  [MF-MSMF030-2]  (value not drawn)
F11  MF-USMF005-2  [MF-MSMF030-2]  (value not drawn)
F12  MF-USMF005-2  [MF-MSMF030-2]  (value not drawn)
F13  MF-USMF005-2  [MF-MSMF030-2]  (value not drawn)
F14  MF-USMF005-2  [MF-MSMF030-2]  (value not drawn)
F15  MF-USMF005-2  [MF-MSMF030-2]  (value not drawn)
IC7  LMV324IDR  [SOIC14N]
IC8  LMV324IDR  [SOIC14N]
IC9  LMV324IDR  [SOIC14N]
L5  Ferrite Bead 0805  [BLM21AG102BH1J]
R69  1k  [0603 CAP]
R70  249  [1206 Res]
R71  1k  [0603 CAP]
R72  1k  [0603 CAP]
R73  1k  [0603 CAP]
R74  1k  [0603 CAP]
R75  1k  [0603 CAP]
R76  249  [1206 Res Kelvin]
R77  1k  [0603 CAP]
R78  1k  [0603 CAP]
R79  249  [1206 Res Kelvin]
R80  1k  [0603 CAP]
R81  249  [1206 Res Kelvin]
R82  1k  [0603 CAP]
R83  249  [1206 Res Kelvin]
R84  1k  [0603 CAP]
R85  249  [1206 Res Kelvin]
R86  1k  [0603 CAP]
R87  1k  [0603 CAP]
R88  1k  [0603 CAP]
R89  1k  [0603 CAP]
R90  1k  [0603 CAP]
R91  249  [1206 Res Kelvin]
R92  1k  [0603 CAP]
R93  1k  [0603 CAP]
R94  249  [1206 Res Kelvin]
R95  1k  [0603 CAP]
R96  249  [1206 Res Kelvin]
R97  1k  [0603 CAP]
R98  1k  [0603 CAP]
R99  1k  [0603 CAP]
R100  1k  [0603 CAP]
R101  1k  [0603 CAP]
R102  249  [1206 Res Kelvin]
R103  1k  [0603 CAP]
R104  1k  [0603 CAP]
R105  249  [1206 Res Kelvin]

### Ports
AI_1, AI_2, Ain_1, Ain_2, Ain_3, Bin_1, Bin_2, Bin_3, Cin_1, Cin_2, Cin_3

### Nets
5V: L5.1
GND: C50.2(-) D14.1 D15.1 D16.1 D17.1 D18.1 D19.1 D20.1 D21.1 D22.1 D23.1 D24.1 IC7.11(GND) IC8.11(GND) IC9.11(GND) R70.1 R72.1 R76.1 R79.1 R81.1 R83.1 R85.1 R87.1 R91.1 R94.1 R96.1 R98.1 R102.1 R105.1  [also labelled 4-20_In1_G, 4-20_In2_G, AIN1_G, AIN2_G, AIN3_G]
OP+: C50.1(+) IC7.4(VCC+) IC8.4(VCC+) IC9.4(VCC+) L5.2
4-20_In1: R80.1
4-20_In2: R84.1
AI_1: F8.2 ; port AI_1
AI_2: F10.2 ; port AI_2
AIN1_P: IC7.14(4OUT) R71.2
AIN2_P: IC8.14(4OUT) R86.2
AIN3_P: IC9.14(4OUT) R97.2
Ain_1: F5.2 ; port Ain_1
Ain_2: F6.2 ; port Ain_2
Ain_3: F7.2 ; port Ain_3
Bin_1: F9.2 ; port Bin_1
Bin_2: F11.2 ; port Bin_2
Bin_3: F12.2 ; port Bin_3
Cin_1: F13.2 ; port Cin_1
Cin_2: F14.2 ; port Cin_2
Cin_3: F15.2 ; port Cin_3
Curr_1A_Out: IC7.3(1IN+) R69.1
Curr_1B_Out: IC8.3(1IN+) R82.1
Curr_1C_Out: IC9.3(1IN+) R95.1
Curr_2A_Out: IC7.5(2IN+) R74.1
Curr_2B_Out: IC8.5(2IN+) R89.1
Curr_2C_Out: IC9.5(2IN+) R100.1
Curr_3A_Out: IC7.10(3IN+) R78.1
Curr_3B_Out: IC8.10(3IN+) R93.1
Curr_3C_Out: IC9.10(3IN+) R104.1
Vbuf_i1A: IC7.1(OUT) IC7.2(1IN-) R73.1
Vbuf_i1B: IC8.1(OUT) IC8.2(1IN-) R88.1
Vbuf_i1C: IC9.1(OUT) IC9.2(1IN-) R99.1
Vbuf_i2A: IC7.6(2IN-) IC7.7(2OUT) R75.1
Vbuf_i2B: IC8.6(2IN-) IC8.7(2OUT) R90.1
Vbuf_i2C: IC9.6(2IN-) IC9.7(2OUT) R101.1
Vbuf_i3A: IC7.8(3OUT) IC7.9(3IN-) IC9.8(3OUT) IC9.9(3IN-) R77.1
Vbuf_i3B: IC8.8(3OUT) IC8.9(3IN-) R92.1
Vbuf_i3C: R103.1
NetD14_2: D14.2 F5.1 R69.2 R70.2
NetD15_2: D15.2 F6.1 R74.2 R76.2
NetD16_2: D16.2 F7.1 R78.2 R79.2
NetD17_2: D17.2 F8.1 R80.2 R81.2
NetD18_2: D18.2 F9.1 R82.2 R83.2
NetD19_2: D19.2 F10.1 R84.2 R85.2
NetD20_2: D20.2 F11.1 R89.2 R91.2
NetD21_2: D21.2 F12.1 R93.2 R94.2
NetD22_2: D22.2 F13.1 R95.2 R96.2
NetD23_2: D23.2 F14.1 R100.2 R102.2
NetD24_2: D24.2 F15.1 R104.2 R105.2
NetIC7_12: IC7.12(4IN+) R73.2 R75.2 R77.2
NetIC7_13: IC7.13(4IN-) R71.1 R72.2
NetIC8_12: IC8.12(4IN+) R88.2 R90.2 R92.2
NetIC8_13: IC8.13(4IN-) R86.1 R87.2
NetIC9_12: IC9.12(4IN+) R99.2 R101.2 R103.2
NetIC9_13: IC9.13(4IN-) R97.1 R98.2

### Library data of the parts
C50 = EEE-FK1V101XP_1: as C9 on sheet PSU; Datasheet Link: http://industrial.panasonic.com/cdbs/www-data/pdf/RDE0000/ABA0000C1181.pdf; Height: 7.8mm; Manufacturer_Part_Number: EEE-FK1V101XP; Mouser Part Number: 667-EEE-FK1V101XP; Mouser Price/Stock: https://www.mouser.co.uk/ProductDetail/Panasonic/EEE-FK1V101XP?qs=qE6bgDGEOCu46KIpIgG5Yw%3D%3D; Arrow Part Number: EEE-FK1V101XP; Arrow Price/Stock: https://www.arrow.com/en/products/eee-fk1v101xp/panasonic?utm_currency=USD&region=europe
D14-D24 = TVS_1_Uni_1: PESD5V0U1UB
F5-F15 = Fuse Resettable: Resettable Fuse Polyswitch
IC7-IC9 = LMV324IDR: Integrated Circuit; Manufacturer_Name: Texas Instruments; Datasheet Link: https://www.ti.com/lit/ds/symlink/lmv324.pdf?ts=1614057377514&ref_url=https%253A%252F%252Fwww.ti.com%252Fstore%252Fti%252Fen%252Fp%252Fproduct%252F%253Fp%253DLMV324IDR; Height: 1.75mm; Manufacturer_Part_Number: LMV324IDR; Mouser Part Number: 595-LMV324IDR; Mouser Price/Stock: https://www.mouser.co.uk/ProductDetail/Texas-Instruments/LMV324IDR?qs=q2XTDbzbm6Ccfg2cd2%252BySw%3D%3D; Arrow Part Number: LMV324IDR; Arrow Price/Stock: https://www.arrow.com/en/products/lmv324idr/texas-instruments?utm_currency=USD&region=nac
L5 = Ferrite Bead
R69 R71-R75 R77 R78 R80 R82 R84 R86-R90 R92 R93 R95 R97-R101 R103 R104 = 0603 RES
R70 = RES 1206: RC1206FR-07249RL
R76 R79 R81 R83 R85 R91 R94 R96 R102 R105 = RES 1206: RT1206BRD07249RL

## Sheet Ethernet.SchDoc
size A3
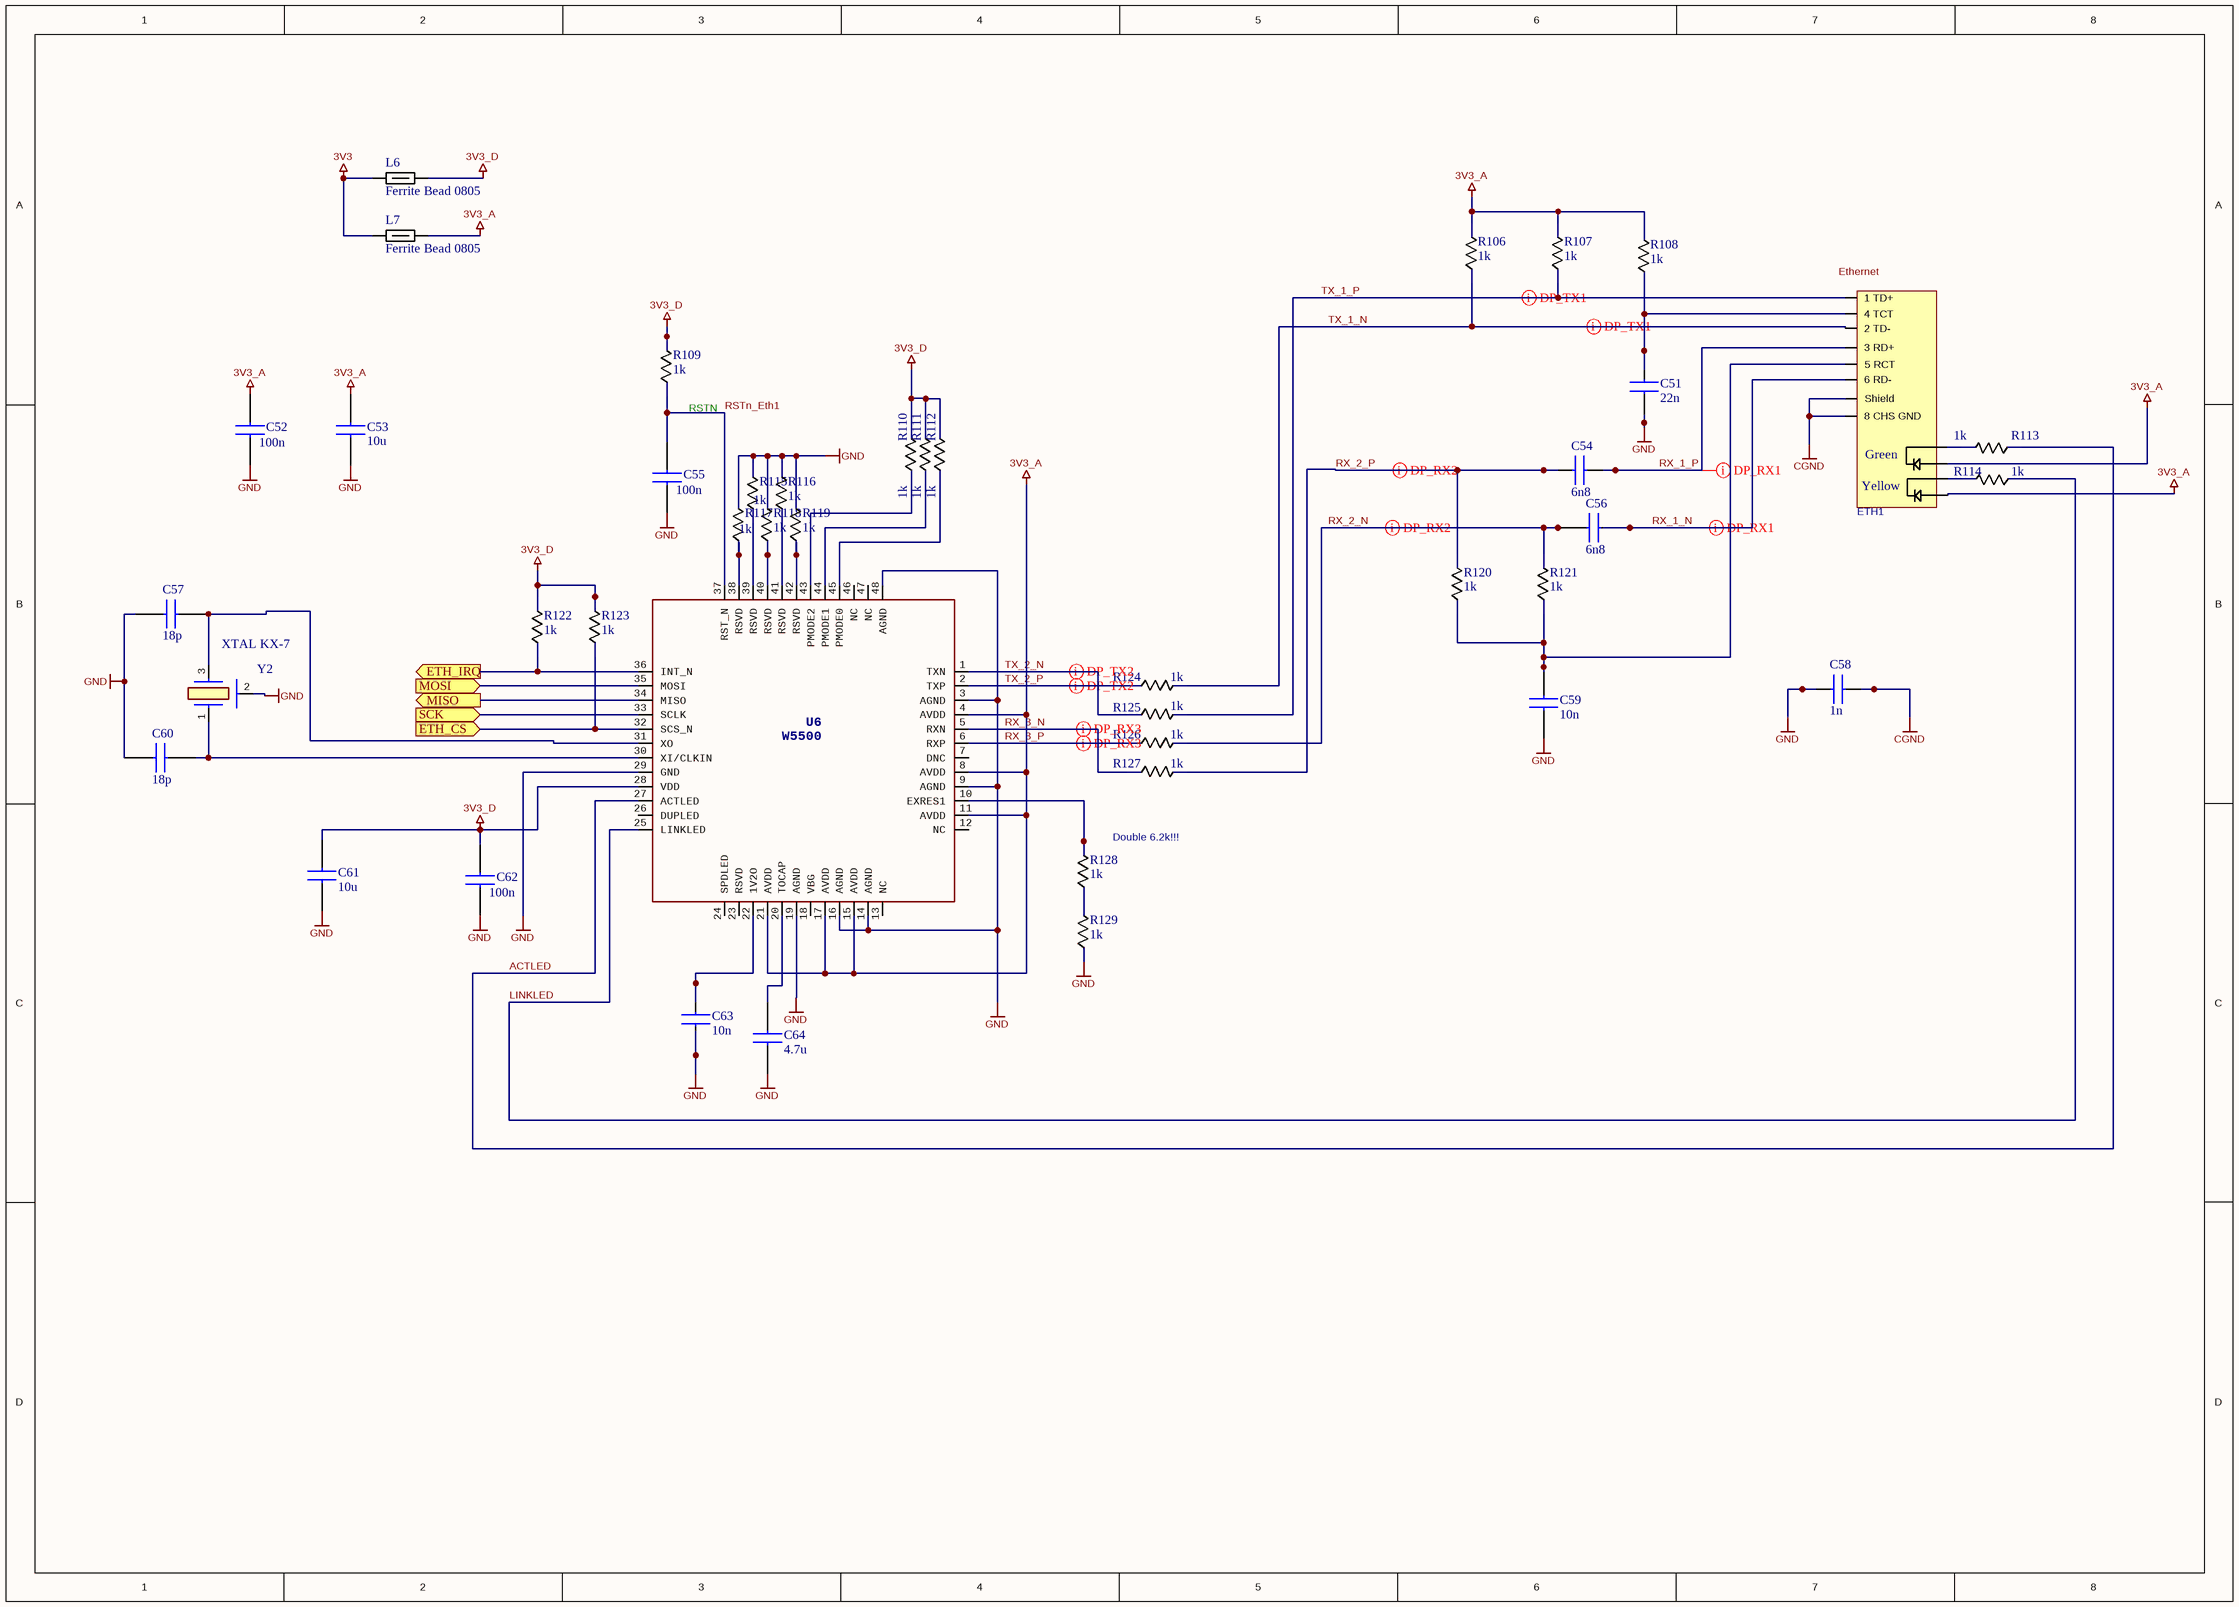
[diagram p3: Ethernet.SchDoc]

### Parts
C51  22n  [0603 CAP]
C52  100n  [0603 CAP]
C53  10u  [0603 CAP]
C54  6n8  [0603 CAP]
C55  100n  [0603 CAP]
C56  6n8  [0603 CAP]
C57  18p  [0603 CAP]
C58  1n  [0603 CAP]
C59  10n  [0603 CAP]
C60  18p  [0603 CAP]
C61  10u  [0603 CAP]
C62  100n  [0603 CAP]
C63  10n  [0603 CAP]
C64  4.7u  [0603 CAP]
ETH1  Ethernet RJ-45 Port  [J011D21BNL]  (value not drawn)
L6  Ferrite Bead 0805  [BLM21AG102BH1J]
L7  Ferrite Bead 0805  [BLM21AG102BH1J]
R106  1k  [0603 CAP]
R107  1k  [0603 CAP]
R108  1k  [0603 CAP]
R109  1k  [0603 CAP]
R110  1k  [0603 CAP]
R111  1k  [0603 CAP]
R112  1k  [0603 CAP]
R113  1k  [0603 CAP]
R114  1k  [0603 CAP]
R115  1k  [0603 CAP]
R116  1k  [0603 CAP]
R117  1k  [0603 CAP]
R118  1k  [0603 CAP]
R119  1k  [0603 CAP]
R120  1k  [0603 CAP]
R121  1k  [0603 CAP]
R122  1k  [0603 CAP]
R123  1k  [0603 CAP]
R124  1k  [0603 CAP]
R125  1k  [0603 CAP]
R126  1k  [0603 CAP]
R127  1k  [0603 CAP]
R128  1k  [0603 CAP]
R129  1k  [0603 CAP]
U6  W5500  [QFP-48]
Y2  XTAL KX-7  [XTAL KX-7]

### Ports
ETH_CS, ETH_IRQ, MISO, MOSI, SCK

### Nets
3V3: L6.1 L7.1
3V3_A: C52.2 C53.2 ETH1.9(LDGr) ETH1.12(LDYE) L7.2 R106.2 R107.2 R108.2 U6.4(AVDD) U6.8(AVDD) U6.11(AVDD) U6.15(AVDD) U6.17(AVDD) U6.21(AVDD)
3V3_D: C61.2 C62.2 L6.2 R109.2 R110.2 R111.2 R112.2 R122.2 R123.2 U6.28(VDD)
CGND: C58.2 ETH1.8(8_CHS_GND) ETH1.SHIELD(Shield)
GND: C51.2 C52.1 C53.1 C55.1 C57.2 C58.1 C59.2 C60.2 C61.1 C62.1 C63.1 C64.1 R115.2 R116.2 R117.2 R118.2 R119.2 R129.1 U6.3(AGND) U6.9(AGND) U6.14(AGND) U6.16(AGND) U6.19(AGND) U6.29(GND) U6.48(AGND) Y2.2
ACTLED: R113.1 U6.27(ACTLED)
ETH_CS: R123.1 U6.32(SCS_N) ; port ETH_CS
ETH_IRQ: R122.1 U6.36(INT_N) ; port ETH_IRQ
LINKLED: R114.1 U6.25(LINKLED)
MISO: U6.34(MISO) ; port MISO
MOSI: U6.35(MOSI) ; port MOSI
RSTn_Eth1: C55.2 R109.1 U6.37(RST_N)
RX_1_N: C56.1 ETH1.6(6_RD-)
RX_1_P: C54.1 ETH1.3(3_RD+)
RX_2_N: C56.2 R121.2 R126.2
RX_2_P: C54.2 R120.2 R127.2
RX_3_N: R127.1 U6.5(RXN)
RX_3_P: R126.1 U6.6(RXP)
SCK: U6.33(SCLK) ; port SCK
TX_1_N: ETH1.2(2_TD-) R106.1 R124.2
TX_1_P: ETH1.1(1_TD+) R107.1 R125.2
TX_2_N: R125.1 U6.1(TXN)
TX_2_P: R124.1 U6.2(TXP)
NetC51_1: C51.1 ETH1.4(4_TCT) R108.1
NetC57_1: C57.1 U6.31(XO) Y2.3
NetC59_1: C59.1 ETH1.5(5_RCT) R120.1 R121.1
NetC60_1: C60.1 U6.30(XI/CLKIN) Y2.1
NetC63_2: C63.2 U6.22(1V2O)
NetC64_2: C64.2 U6.20(TOCAP)
NetETH1_10: ETH1.10(LDGr) R113.2
NetETH1_11: ETH1.11(LDYE) R114.2
NetR110_1: R110.1 U6.43(PMODE2)
NetR111_1: R111.1 U6.44(PMODE1)
NetR112_1: R112.1 U6.45(PMODE0)
NetR115_1: R115.1 U6.39(RSVD)
NetR116_1: R116.1 U6.41(RSVD)
NetR117_1: R117.1 U6.38(RSVD)
NetR118_1: R118.1 U6.40(RSVD)
NetR119_1: R119.1 U6.42(RSVD)
NetR128_1: R128.1 R129.2
NetR128_2: R128.2 U6.10(EXRES1)

Not connected (* = marked no-connect by the designer): U6 7(DNC) 12(NC) 13(NC) 18(VBG) 23(RSVD) 24(SPDLED) 26(DUPLED) 46(NC) 47(NC)

### Layout directives
differential pair: RX_1_N, RX_1_P, RX_2_N, RX_2_P, RX_3_N, RX_3_P, TX_1_N, TX_1_P, TX_2_N, TX_2_P

### Notes on the sheet
- (near ETH1) Ethernet
- (near R109) RSTN
- (near R128) Double 6.2k!!!
- (in symbol J0011D21BNL) Green; Yellow

### Library data of the parts
C51 = 0603 CAP: GRM188R71H223KA01D; Manufacturer_Name: Murata Electronics; Manufacturer_Part_Number: GRM188R72A103KA01D; Datasheet Link: https://search.murata.co.jp/Ceramy/image/img/A01X/G101/ENG/GRM188R72A103KA01-01A.pdf; Height: 0.9mm; Mouser Part Number: 81-GRM188R72A103KA1D; Mouser Price/Stock: https://www.mouser.co.uk/ProductDetail/Murata-Electronics/GRM188R72A103KA01D?qs=krk%2F6UQjCzAtl9phuocbug%3D%3D; Arrow Part Number: GRM188R72A103KA01D; Arrow Price/Stock: https://www.arrow.com/en/products/grm188r72a103ka01d/murata-manufacturing?region=europe
C52 C55 C62 = 0603 CAP: as C5 on sheet PSU; Datasheet Link: https://search.murata.co.jp/Ceramy/image/img/A01X/G101/ENG/GRM188R72A103KA01-01A.pdf; Height: 0.9mm; Mouser Part Number: 81-GRM188R72A103KA1D; Mouser Price/Stock: https://www.mouser.co.uk/ProductDetail/Murata-Electronics/GRM188R72A103KA01D?qs=krk%2F6UQjCzAtl9phuocbug%3D%3D; Arrow Part Number: GRM188R72A103KA01D; Arrow Price/Stock: https://www.arrow.com/en/products/grm188r72a103ka01d/murata-manufacturing?region=europe
C53 C61 = 0603 CAP: as C8 on sheet PSU; Datasheet Link: https://search.murata.co.jp/Ceramy/image/img/A01X/G101/ENG/GRM188R72A103KA01-01A.pdf; Height: 0.9mm; Mouser Part Number: 81-GRM188R72A103KA1D; Mouser Price/Stock: https://www.mouser.co.uk/ProductDetail/Murata-Electronics/GRM188R72A103KA01D?qs=krk%2F6UQjCzAtl9phuocbug%3D%3D; Arrow Part Number: GRM188R72A103KA01D; Arrow Price/Stock: https://www.arrow.com/en/products/grm188r72a103ka01d/murata-manufacturing?region=europe
C54 C56 = 0603 CAP: CC0603KRX7R9BB682; Manufacturer_Name: Murata Electronics; Manufacturer_Part_Number: GRM188R72A103KA01D; Datasheet Link: https://search.murata.co.jp/Ceramy/image/img/A01X/G101/ENG/GRM188R72A103KA01-01A.pdf; Height: 0.9mm; Mouser Part Number: 81-GRM188R72A103KA1D; Mouser Price/Stock: https://www.mouser.co.uk/ProductDetail/Murata-Electronics/GRM188R72A103KA01D?qs=krk%2F6UQjCzAtl9phuocbug%3D%3D; Arrow Part Number: GRM188R72A103KA01D; Arrow Price/Stock: https://www.arrow.com/en/products/grm188r72a103ka01d/murata-manufacturing?region=europe
C57 C60 = 0603 CAP: as C46 on sheet MCU; Datasheet Link: https://search.murata.co.jp/Ceramy/image/img/A01X/G101/ENG/GRM188R72A103KA01-01A.pdf; Height: 0.9mm; Mouser Part Number: 81-GRM188R72A103KA1D; Mouser Price/Stock: https://www.mouser.co.uk/ProductDetail/Murata-Electronics/GRM188R72A103KA01D?qs=krk%2F6UQjCzAtl9phuocbug%3D%3D; Arrow Part Number: GRM188R72A103KA01D; Arrow Price/Stock: https://www.arrow.com/en/products/grm188r72a103ka01d/murata-manufacturing?region=europe
C58 = 0603 CAP: CC1206KKX7RDBB102; Manufacturer_Name: Murata Electronics; Manufacturer_Part_Number: GRM188R72A103KA01D; Datasheet Link: https://search.murata.co.jp/Ceramy/image/img/A01X/G101/ENG/GRM188R72A103KA01-01A.pdf; Height: 0.9mm; Mouser Part Number: 81-GRM188R72A103KA1D; Mouser Price/Stock: https://www.mouser.co.uk/ProductDetail/Murata-Electronics/GRM188R72A103KA01D?qs=krk%2F6UQjCzAtl9phuocbug%3D%3D; Arrow Part Number: GRM188R72A103KA01D; Arrow Price/Stock: https://www.arrow.com/en/products/grm188r72a103ka01d/murata-manufacturing?region=europe
C59 C63 = 0603 CAP: CC0603JRX7R9BB103; Manufacturer_Name: Murata Electronics; Manufacturer_Part_Number: GRM188R72A103KA01D; Datasheet Link: https://search.murata.co.jp/Ceramy/image/img/A01X/G101/ENG/GRM188R72A103KA01-01A.pdf; Height: 0.9mm; Mouser Part Number: 81-GRM188R72A103KA1D; Mouser Price/Stock: https://www.mouser.co.uk/ProductDetail/Murata-Electronics/GRM188R72A103KA01D?qs=krk%2F6UQjCzAtl9phuocbug%3D%3D; Arrow Part Number: GRM188R72A103KA01D; Arrow Price/Stock: https://www.arrow.com/en/products/grm188r72a103ka01d/murata-manufacturing?region=europe
C64 = 0603 CAP: GRM188R61A475KE15D; Manufacturer_Name: Murata Electronics; Manufacturer_Part_Number: GRM188R72A103KA01D; Datasheet Link: https://search.murata.co.jp/Ceramy/image/img/A01X/G101/ENG/GRM188R72A103KA01-01A.pdf; Height: 0.9mm; Mouser Part Number: 81-GRM188R72A103KA1D; Mouser Price/Stock: https://www.mouser.co.uk/ProductDetail/Murata-Electronics/GRM188R72A103KA01D?qs=krk%2F6UQjCzAtl9phuocbug%3D%3D; Arrow Part Number: GRM188R72A103KA01D; Arrow Price/Stock: https://www.arrow.com/en/products/grm188r72a103ka01d/murata-manufacturing?region=europe
ETH1 = J0011D21BNL
L6 L7 = Ferrite Bead
R106-R129 = 0603 RES
Y2 = XTAL KX-7: as Y1 on sheet MCU; Datasheet Link: https://www.mouser.com/datasheet/2/905/c_NX3215SA-STD-MUA-14_e-1317539.pdf; Height: 0.9mm; Mouser Part Number: 344-NX3215SA32768K14; Mouser Price/Stock: https://www.mouser.co.uk/ProductDetail/NDK/NX3215SA-32.768K-STD-MUA-14?qs=55YtniHzbhCTyKGENMTVrQ%3D%3D

## Sheet LEDs.SchDoc
size A4
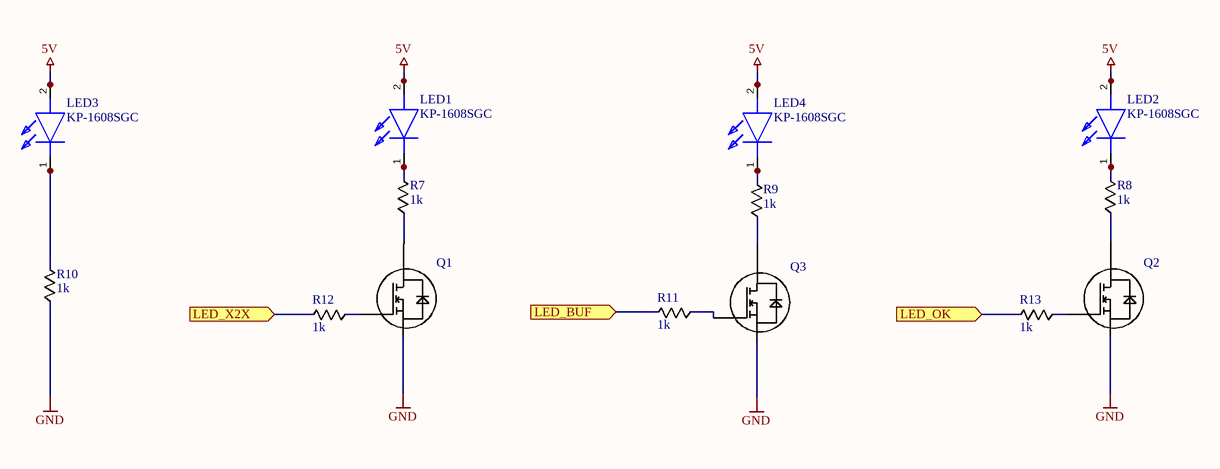
[diagram p4: LEDs.SchDoc]

### Parts
LED1  KP-1608SGC  [KP-1608SGC]
LED2  KP-1608SGC  [KP-1608SGC]
LED3  KP-1608SGC  [KP-1608SGC]
LED4  KP-1608SGC  [KP-1608SGC]
Q1  MOSFET-N  [SOT-23]  (value not drawn)
Q2  MOSFET-N  [SOT-23]  (value not drawn)
Q3  MOSFET-N  [SOT-23]  (value not drawn)
R7  1k  [0603 CAP]
R8  1k  [0603 CAP]
R9  1k  [0603 CAP]
R10  1k  [0603 CAP]
R11  1k  [0603 CAP]
R12  1k  [0603 CAP]
R13  1k  [0603 CAP]

### Ports
LED_BUF, LED_OK, LED_X2X

### Nets
5V: LED1.2(A) LED2.2(A) LED3.2(A) LED4.2(A)
GND: Q1.2(S) Q2.2(S) Q3.2(S) R10.1
LED_BUF: R11.2 ; port LED_BUF
LED_OK: R13.2 ; port LED_OK
LED_X2X: R12.2 ; port LED_X2X
NetLED1_1: LED1.1(K) R7.2
NetLED2_1: LED2.1(K) R8.2
NetLED3_1: LED3.1(K) R10.2
NetLED4_1: LED4.1(K) R9.2
NetQ1_1: Q1.1(G) R12.1
NetQ1_3: Q1.3(D) R7.1
NetQ2_1: Q2.1(G) R13.1
NetQ2_3: Q2.3(D) R8.1
NetQ3_1: Q3.1(G) R11.1
NetQ3_3: Q3.3(D) R9.1

### Library data of the parts
LED1-LED4 = KP-1608SGC: Manufacturer_Name: Kingbright; Datasheet Link: KP-1608SGC; Height: 1.2mm; Manufacturer_Part_Number: KP-1608SGC; Mouser Part Number: N/A; Mouser Price/Stock: https://www.mouser.co.uk/ProductDetail/Kingbright/KP-1608SGC?qs=2JU0tDl2GZ13Q%2F1QAsmViw%3D%3D; Arrow Part Number: KP-1608SGC; Arrow Price/Stock: https://www.arrow.com/en/products/kp-1608sgc/kingbright?utm_currency=USD&region=nac
Q1-Q3 = BSS138: IRLML2502TR
R7-R13 = 0603 RES

## Nets that join several sheets
3V3: PSU (C11.1 C13.2 U2.5), MCU (7 pins), Ethernet (L6.1 L7.1)
5V: PSU (C9.1 C10.2 U3.2), MCU (18 pins), 4-20 (L5.1), LEDs (LED1.2 LED2.2 LED3.2 LED4.2)
GND: PSU (21 pins), MCU (38 pins), 4-20 (29 pins), Ethernet (26 pins), LEDs (Q1.2 Q2.2 Q3.2 R10.1)
ETH_CS: MCU (IC3.19), Ethernet (R123.1 U6.32)
ETH_IRQ: MCU (IC3.26), Ethernet (R122.1 U6.36)
LED_X2X: MCU (IC3.49), LEDs (R12.2)
MISO: MCU (IC3.22 IC6.2 PL7.9), Ethernet (U6.34)
MOSI: MCU (IC3.21 IC5.2 PL7.1), Ethernet (U6.35)
SCK: MCU (IC3.20 IC5.5 PL7.7), Ethernet (U6.33)
Vbuf_i2A: MCU (R63.2), 4-20 (IC7.6 IC7.7 R75.1)
Vbuf_i2B: MCU (R62.2), 4-20 (IC8.6 IC8.7 R90.1)
Vbuf_i2C: MCU (R64.2), 4-20 (IC9.6 IC9.7 R101.1)